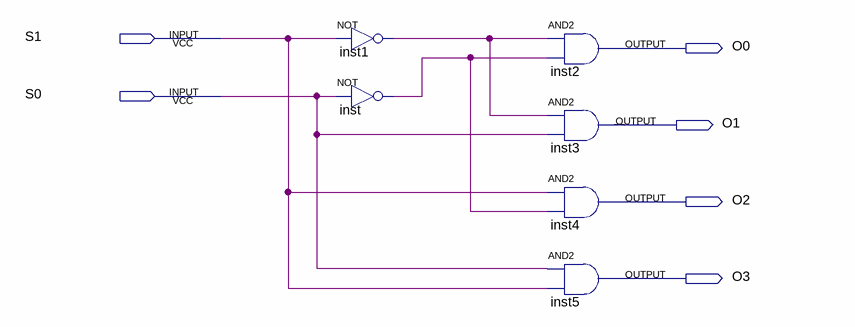
[diagram p0: schematic sheet]
// Quartus schematic Decoder.bdf as structural Verilog: 6 symbols, 6 pins
module Decoder (
  input  S1,
  input  S0,
  output O0,
  output O1,
  output O2,
  output O3
);

  wire inst1_out, inst_out;

  not inst1 (inst1_out, S1);
  not inst (inst_out, S0);
  and inst2 (O0, inst1_out, inst_out);
  and inst3 (O1, inst1_out, S0);
  and inst4 (O2, S1, inst_out);
  and inst5 (O3, S0, S1);
endmodule
